# EAGLE schematic Zigzag 5p ATtiny connector (EAGLE 7.6.0)
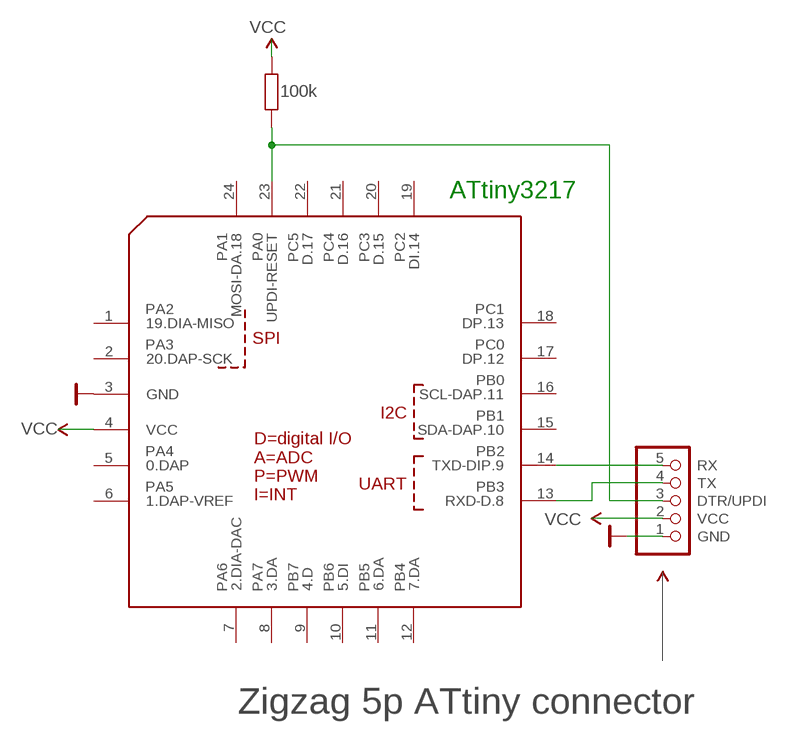
[diagram p0: schematic, sheet 1]
V2 (ARROW): VALUE: x
V5 (ARROW): VALUE: x
V6 (ARROW): VALUE: x
V7 (ARROW): VALUE: x

## Parts
J1  5 pin 0.05" ZIGZAG connector  ZIGZAG-FTDI-UPDI-5P  [ZIGZAG-FTDI-UPDI-5P]
R1  100k  SMD-R0603  [0603]
U2  ATtiny3217  ATTINY3217-  [QFN-24]

## Nets
DTR/UPDI: J1.3(DTR/UPDI) R1.1 U2.23(UPDI-RESET)
GND: J1.1(GND) U2.3(GND)
N$1: J1.5(RX) U2.14(TXD-DIP.9)
N$2: J1.4(TX) U2.13(RXD-D.8)
VCC: J1.2(VCC) R1.2 U2.4(VCC)
Unconnected: U2.1(19.DIA-MISO) U2.2(20.DAP-SCK) U2.5(0.DAP) U2.6(1.DAP-VREF) U2.7(2.DIA-DAC) U2.8(3.DA) U2.9(4.D) U2.10(5.DI) U2.11(6.DA) U2.12(7.DA) U2.15(SDA-DAP.10) U2.16(SCL-DAP.11) U2.17(DP.12) U2.18(DP.13) U2.19(DI.14) U2.20(D.15) U2.21(D.16) U2.22(D.17) U2.24(MOSI-DA.18)

## Notes on the sheet
- ATtiny3217
- Zigzag 5p ATtiny connector

## Library data of the parts
J1 = Albert:ZIGZAG-FTDI-UPDI-5P
R1 = Albert:SMD-R: Resistor
U2 = Albert-Arduino:ATTINY3217: MICROCONTROLLER 4 Kbytes FLASH 128 bytes SRAM 256 bytes EEPROM UART 6-channel 10 bit ADC